# EAGLE design ARE_adaptadora_STM32_64pin (EAGLE 6.5.0)
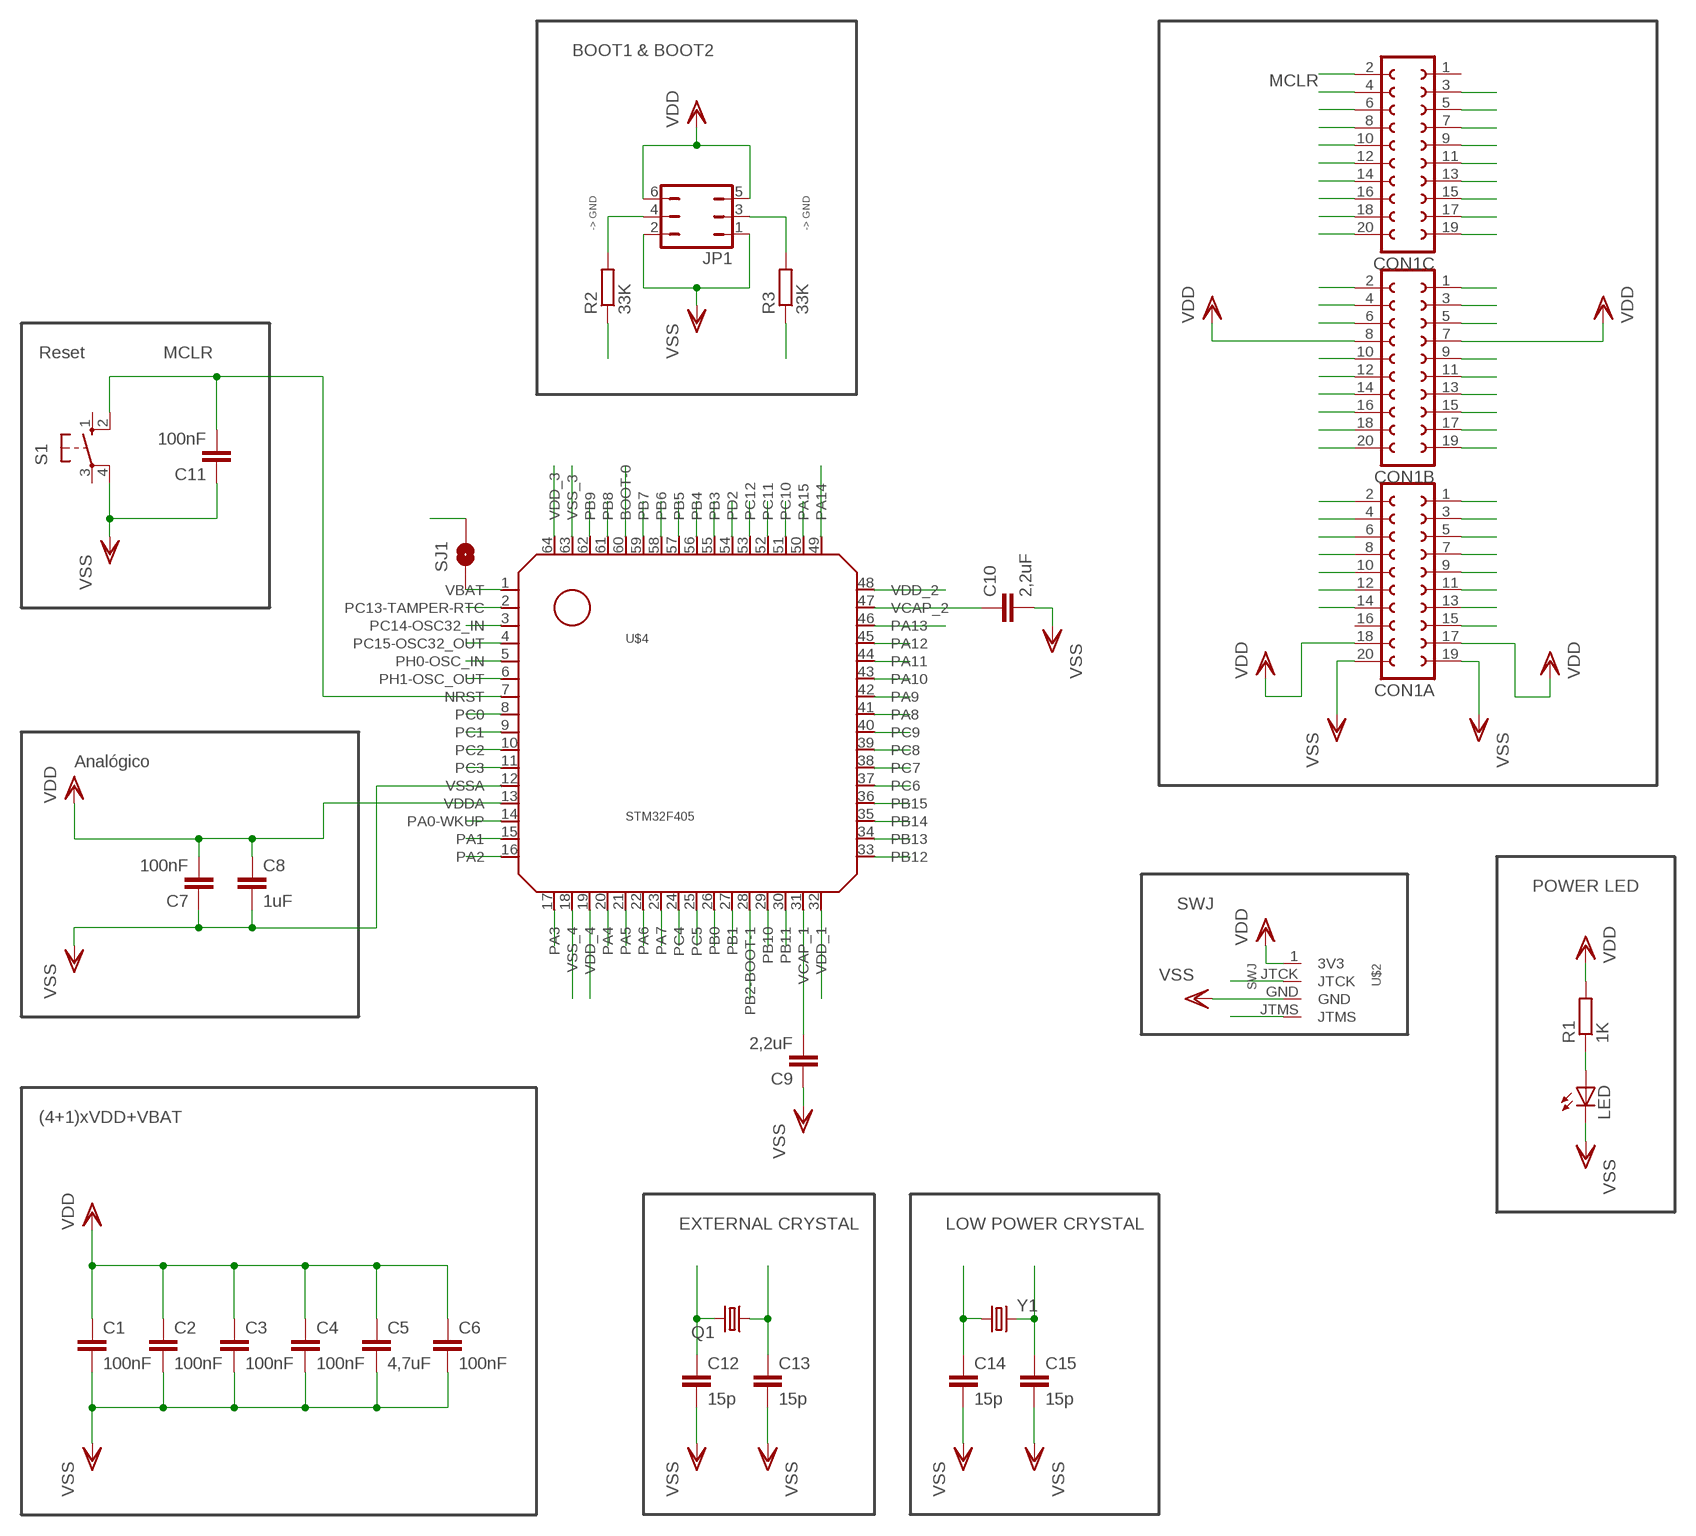
[diagram p0: schematic, sheet 1]

## Parts
C1  100nF  C-EUC0805K  [C0805K]
C2  100nF  C-EUC0805K  [C0805K]
C3  100nF  C-EUC0805K  [C0805K]
C4  100nF  C-EUC0805K  [C0805K]
C5  4,7uF  C-EUC0805K  [C0805K]
C6  100nF  C-EUC0805K  [C0805K]
C7  100nF  C-EUC0805K  [C0805K]
C8  1uF  C-EUC0805K  [C0805K]
C9  2,2uF  C-EUC0805K  [C0805K]
C10  2,2uF  C-EUC0805K  [C0805K]
C11  100nF  C-EUC0805K  [C0805K]
C12  15p  C-EUC0805  [C0805]
C13  15p  C-EUC0805  [C0805]
C14  15p  C-EUC0805  [C0805]
C15  15p  C-EUC0805  [C0805]
CON1A  FE10-2W  [FE10-2W]
CON1B  FE10-2W  [FE10-2W]
CON1C  FE10-2W  [FE10-2W]
JP1  JP3Q  [JP3Q]
LED  LEDCHIPLED_0805  [CHIPLED_0805]
Q1  CRYSTALHC18U-V  [HC18U-V]
R1  1K  R-EU_R0805  [R0805]
R2  33K  R-EU_R0805  [R0805]
R3  33K  R-EU_R0805  [R0805]
S1  10-XX  [B3F-10XX]
SJ1  SOLDERJUMPERNO  [SJ_2S-NO]
U$2  SWJ  [SWJ]
U$4  STM32F405  [LQFP64]
Y1  CRYSTAL32-SMD  [CRYSTAL-32KHZ-SMD]

## Nets
BOOT0: R2.1 U$4.60(BOOT-0)
BOOT1: CON1B.3 R3.1 U$4.28(PB2-BOOT-1)
JTCK: CON1A.3 U$2.JTCK U$4.49(PA14)
JTMS: CON1A.2 U$2.JTMS U$4.46(PA13)
MCLR: C11.2 CON1C.2 S1.2(S1) U$4.7(NRST)
N$22: C10.1 U$4.47(VCAP_2)
N$23: C9.2 U$4.31(VCAP_1)
N$24: CON1C.4 U$4.2(PC13-TAMPER-RTC)
N$25: LED.A R1.1
N$33: CON1C.7 U$4.8(PC0)
N$34: CON1C.10 U$4.9(PC1)
N$35: CON1C.9 U$4.10(PC2)
N$36: CON1C.12 U$4.11(PC3)
N$37: CON1C.11 U$4.14(PA0-WKUP)
N$38: CON1C.14 U$4.15(PA1)
N$39: CON1C.13 U$4.16(PA2)
N$40: CON1C.16 U$4.17(PA3)
N$41: CON1C.15 U$4.20(PA4)
N$42: CON1C.18 U$4.21(PA5)
N$43: CON1C.17 U$4.22(PA6)
N$44: CON1C.20 U$4.23(PA7)
N$45: CON1C.19 U$4.24(PC4)
N$46: CON1B.2 U$4.25(PC5)
N$47: CON1B.1 U$4.26(PB0)
N$48: CON1B.4 U$4.27(PB1)
N$49: CON1B.6 U$4.29(PB10)
N$50: CON1B.5 U$4.30(PB11)
N$51: CON1B.9 U$4.33(PB12)
N$52: CON1B.10 U$4.34(PB13)
N$53: CON1B.11 U$4.35(PB14)
N$54: CON1B.12 U$4.36(PB15)
N$55: CON1B.13 U$4.37(PC6)
N$56: CON1B.14 U$4.38(PC7)
N$57: CON1B.15 U$4.39(PC8)
N$58: CON1B.16 U$4.40(PC9)
N$59: CON1B.17 U$4.41(PA8)
N$60: CON1B.18 U$4.42(PA9)
N$61: CON1B.19 U$4.43(PA10)
N$62: CON1B.20 U$4.44(PA11)
N$63: CON1A.1 U$4.45(PA12)
N$64: CON1A.4 U$4.50(PA15)
N$65: CON1A.5 U$4.51(PC10)
N$66: CON1A.6 U$4.52(PC11)
N$67: CON1A.7 U$4.53(PC12)
N$68: CON1A.8 U$4.54(PD2)
N$69: CON1A.9 U$4.55(PB3)
N$70: CON1A.10 U$4.56(PB4)
N$72: CON1A.11 U$4.57(PB5)
N$73: CON1A.12 U$4.58(PB6)
N$74: CON1A.13 U$4.59(PB7)
N$75: CON1A.14 U$4.61(PB8)
N$76: CON1A.15 U$4.62(PB9)
N$77: JP1.4 R2.2
N$78: JP1.3 R3.2
P12OSC0: C13.1 CON1C.5 Q1.1 U$4.5(PH0-OSC_IN)
P12OSC1: C12.1 CON1C.8 Q1.2 U$4.6(PH1-OSC_OUT)
P12OSC320: C14.1 CON1C.3 U$4.3(PC14-OSC32_IN) Y1.X1
P12OSC321: C15.1 CON1C.6 U$4.4(PC15-OSC32_OUT) Y1.X2
VBAT: SJ1.1 U$4.1(VBAT)
VDD: C1.1 C2.1 C3.1 C4.1 C5.1 C6.1 C7.2 C8.1 CON1A.17 CON1A.18 CON1B.7 CON1B.8 JP1.5 JP1.6 R1.2 SJ1.2 U$2.1(3V3) U$4.13(VDDA) U$4.19(VDD_4) U$4.32(VDD_1) U$4.48(VDD_2) U$4.64(VDD_3)
VSS: C1.2 C2.2 C3.2 C4.2 C5.2 C6.2 C7.1 C8.2 C9.1 C10.2 C11.1 C12.2 C13.2 C14.2 C15.2 CON1A.19 CON1A.20 JP1.1 JP1.2 LED.C S1.4(P1) U$2.GND U$4.12(VSSA) U$4.18(VSS_4) U$4.63(VSS_3)
Unconnected: CON1A.16 CON1C.1 S1.1(S) S1.3(P)

## Notes on the sheet
- BOOT1 & BOOT2
- -> GND | -> GND
- Reset
- Analógico
- POWER LED
- SWJ
- (4+1)xVDD+VBAT
- EXTERNAL CRYSTAL | LOW POWER CRYSTAL

## Library data of the parts
C1-C15 = rcl:C-EU: CAPACITOR, European symbol
CON1A CON1B CON1C = con-lsta:FE10-2W: FEMALE HEADER; OC_FARNELL: unknown; OC_NEWARK: unknown
JP1 = jumper:JP3Q: JUMPER
LED = led:LED: LED OSRAM: - CHIPLED LG R971, LG N971, LY N971, LG Q971, LY Q971, LO R971, LY R971 LH N974, LH R974 LS Q976, LO Q976, LY Q976 LO Q996 - Hyper CHIPLED LW Q18S LB Q993, LB Q99A, LB R99A - SideLED LS A670, LO A670, LY A670, LG A670, LP A670 LB A673, LV A673, LT A673, LW A673 LH A674 LY A675 LS A676, LA A676, LO A676, LY A676, LW A676 LS A679, LY A679, LG A679 - Hyper Micro SIDELED® LS Y876, LA Y876, LO Y876, LY Y876 LT Y87S - SmartLED LW L88C, LW L88S LB L89C, LB L89S, LG L890 LS L89K, LO L89K, LY L89K LS L896, LA L896, LO L896, LY L896 - TOPLED LS T670, LO T670, LY T670, LG T670, LP T670 LSG T670, LSP T670, LSY T670, LOP T670, LYG T670 LG T671, LOG T671, LSG T671 LB T673, LV T673, LT T673, LW T673 LH T674 LS T676, LA T676, LO T676, LY T676, LB T676, LH T676, LSB T676, LW T676 LB T67C, LV T67C, LT T67C, LS T67K, LO T67K, LY T67K, LW E67C LS E67B, LA E67B, LO E67B, LY E67B, LB E67C, LV E67C, LT E67C LW T67C LS T679, LY T679, LG T679 LS T770, LO T770, LY T770, LG T770, LP T770 LB T773, LV T773, LT T773, LW T773 LH T774 LS E675, LA E675, LY E675, LS T675 LS T776, LA T776, LO T776, LY T776, LB T776 LHGB T686 LT T68C, LB T68C - Hyper Mini TOPLED® LB M676 - Mini TOPLED Santana® LG M470 LS M47K, LO M47K, LY M47K Source: http://www.osram.convergy.de LUXEON: - LUMILED® LXK2-PW12-R00, LXK2-PW12-S00, LXK2-PW14-U00, LXK2-PW14-V00 LXK2-PM12-R00, LXK2-PM12-S00, LXK2-PM14-U00 LXK2-PE12-Q00, LXK2-PE12-R00, LXK2-PE12-S00, LXK2-PE14-T00, LXK2-PE14-U00 LXK2-PB12-K00, LXK2-PB12-L00, LXK2-PB12-M00, LXK2-PB14-N00, LXK2-PB14-P00, LXK2-PB14-Q00 LXK2-PR12-L00, LXK2-PR12-M00, LXK2-PR14-Q00, LXK2-PR14-R00 LXK2-PD12-Q00, LXK2-PD12-R00, LXK2-PD12-S00 LXK2-PH12-R00, LXK2-PH12-S00 LXK2-PL12-P00, LXK2-PL12-Q00, LXK2-PL12-R00 Source: www.luxeon.com KINGBRIGHT: KA-3528ASYC Source: www.kingbright.com
Q1 = crystal:CRYSTAL: CRYSTAL; OC_FARNELL: unknown; OC_NEWARK: unknown
R1-R3 = rcl:R-EU_: RESISTOR, European symbol
S1 = switch-omron:10-XX: OMRON SWITCH; MPN: B3F-1000; OC_FARNELL: 176432; OC_NEWARK: 36M3542
SJ1 = SparkFun-Passives:SOLDERJUMPER: Solder Jumper Standard SMD solder jumper. Used to automate production. Two varients : Normally Open and Normally Closed are the same, but have different paste layers. NC will have a large amount of paste and should jumper during reflow.
U$2 = Propio:SWJ
U$4 = Propio:STM32F405
Y1 = SparkFun-FreqCtrl:CRYSTAL: Various standard crystals. Proven footprints. Spark Fun Electronics SKU : COM-00534

## Board
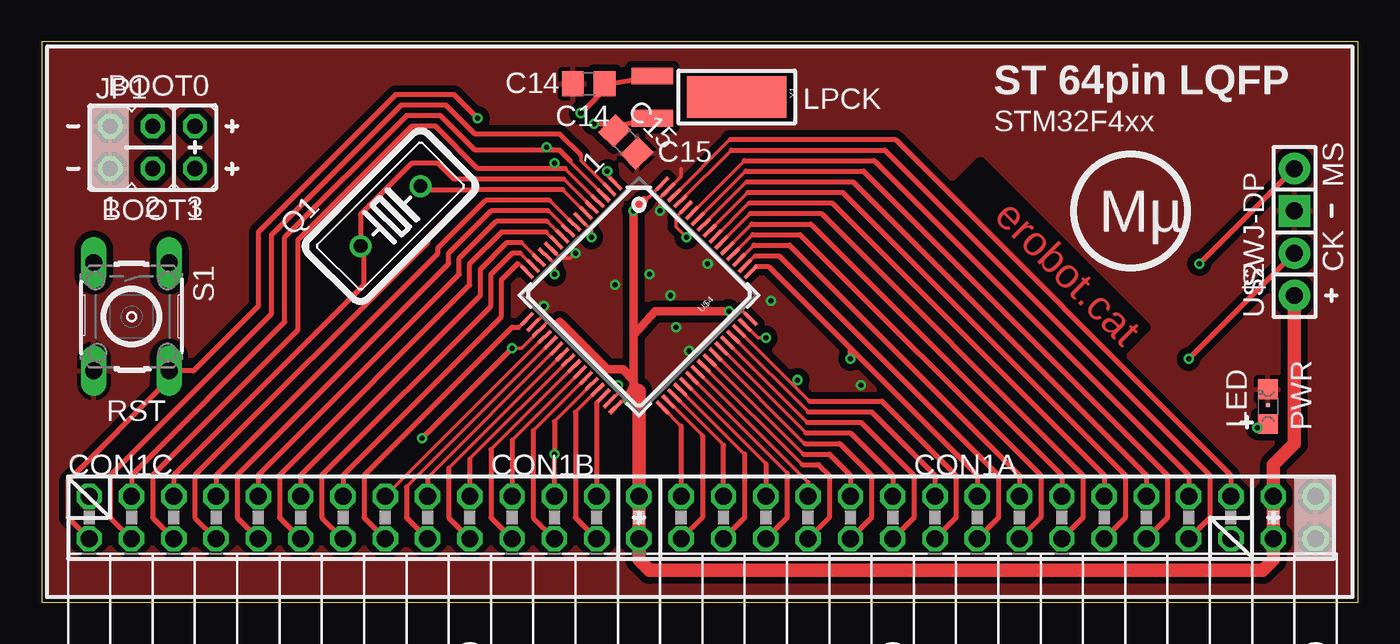
[diagram p1: board, top side]
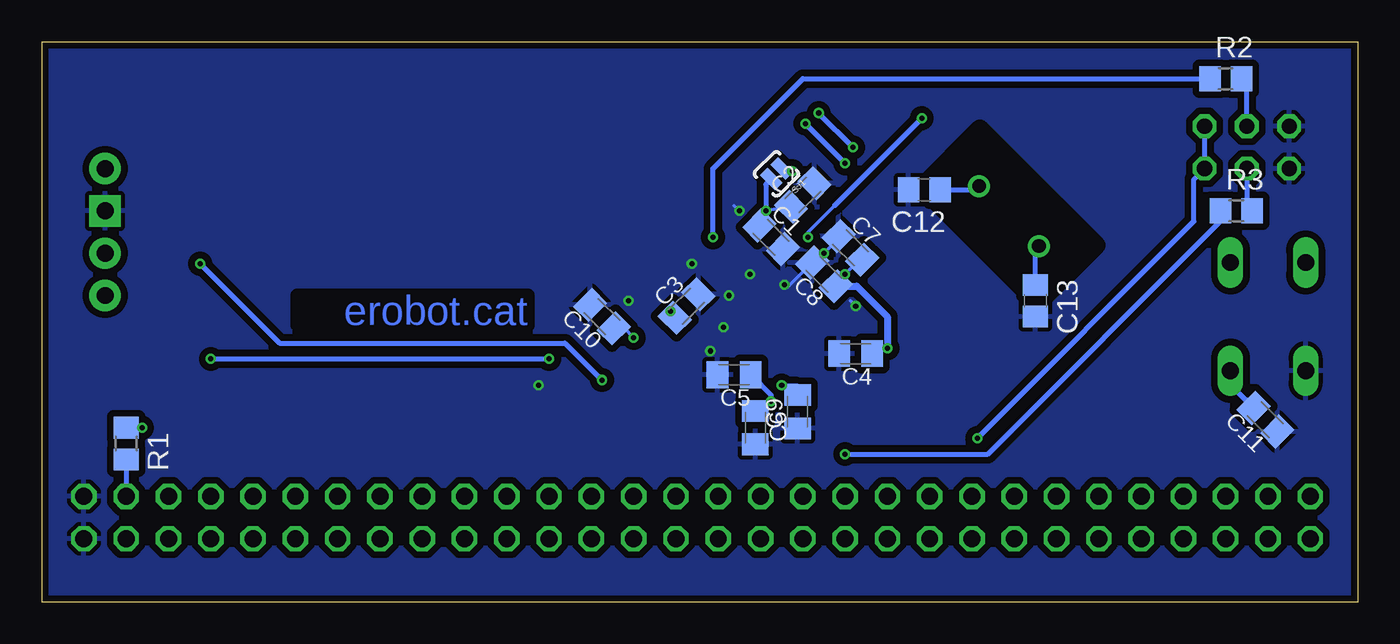
[diagram p2: board, bottom side, seen from below]

Size 79.06 x 33.66 mm. Coordinates in mm from the lower left corner, seen from the top.
Outline: 0,0 79.06,0 79.06,33.65 0,33.65 0,0
Copper layers (1*16): Top 0.035mm / dielectric 1.5mm / Bottom 0.035mm
Design rules "ITEADstudio_DRC": minimum track width 6mil, minimum drill 12mil, track to track 6mil, track to pad 6mil, pad to pad 6mil, via to via 6mil, smd to smd 0mil, copper to edge 10mil, drill to drill 10mil, minimum pad ring 10mil, minimum via ring 6mil, stop-mask expansion 2mil, vias tented up to drill 100mil, thermal gap 10mil
bRestrict: area 15.7,17.9 to 26.2,28.4

### Footprints (pad centres in the part's own frame; a part is rotated, then mirrored left to right if it is on the bottom)
C0805K = smd 1.3 x 1.6: 1 -1,0; 2 1,0
C0805 = smd 1.3 x 1.5: 1 -0.95,0; 2 0.95,0
FE10-2W = drill 1.016 octagon: 1 -11.43,1.27; 2 -11.43,-1.27; 3 -8.89,1.27; 4 -8.89,-1.27; 5 -6.35,1.27; 6 -6.35,-1.27; 7 -3.81,1.27; 8 -3.81,-1.27; 9 -1.27,1.27; 10 -1.27,-1.27; 11 1.27,1.27; 12 1.27,-1.27; 13 3.81,1.27; 14 3.81,-1.27; 15 6.35,1.27; 16 6.35,-1.27; 17 8.89,1.27; 18 8.89,-1.27; 19 11.43,1.27; 20 11.43,-1.27
JP3Q = drill 0.914 octagon: 1 -2.54,-1.27; 2 -2.54,1.27; 3 0,-1.27; 4 0,1.27; 5 2.54,-1.27; 6 2.54,1.27
CHIPLED_0805 = smd 1.2 x 1.2: A 0,-1.05; C 0,1.05
HC18U-V = drill 0.813: 1 -2.54,0; 2 2.54,0
R0805 = smd 1.3 x 1.5: 1 -0.95,0; 2 0.95,0
B3F-10XX = drill 1.016 long: 1 -3.251,2.261; 2 3.251,2.261; 3 -3.251,-2.261; 4 3.251,-2.261
SJ_2S-NO = smd 0.635 x 1.27: 1 -0.45,0; 2 0.45,0
SWJ = drill 1.016 pad 1.88: 1 -5.08,0; JTCK -2.54,0; JTMS 2.54,0 | drill 1.016 pad 1.88 square: GND 0,0
LQFP64 = smd 0.22 x 1: 1 -3.75,-5.75; 2 -3.25,-5.75; 3 -2.75,-5.75; 4 -2.25,-5.75; 5 -1.75,-5.75; 6 -1.25,-5.75; 7 -0.75,-5.75; 8 -0.25,-5.75; 9 0.25,-5.75; 10 0.75,-5.75; 11 1.25,-5.75; 12 1.75,-5.75; 13 2.25,-5.75; 14 2.75,-5.75; 15 3.25,-5.75; 16 3.75,-5.75; 33 3.75,5.75; 34 3.25,5.75; 35 2.75,5.75; 36 2.25,5.75; 37 1.75,5.75; 38 1.25,5.75; 39 0.75,5.75; 40 0.25,5.75; 41 -0.25,5.75; 42 -0.75,5.75; 43 -1.25,5.75; 44 -1.75,5.75; 45 -2.25,5.75; 46 -2.75,5.75; 47 -3.25,5.75; 48 -3.75,5.75 | smd 1 x 0.22: 17 5.75,-3.75; 18 5.75,-3.25; 19 5.75,-2.75; 20 5.75,-2.25; 21 5.75,-1.75; 22 5.75,-1.25; 23 5.75,-0.75; 24 5.75,-0.25; 25 5.75,0.25; 26 5.75,0.75; 27 5.75,1.25; 28 5.75,1.75; 29 5.75,2.25; 30 5.75,2.75; 31 5.75,3.25; 32 5.75,3.75; 49 -5.75,3.75; 50 -5.75,3.25; 51 -5.75,2.75; 52 -5.75,2.25; 53 -5.75,1.75; 54 -5.75,1.25; 55 -5.75,0.75; 56 -5.75,0.25; 57 -5.75,-0.25; 58 -5.75,-0.75; 59 -5.75,-1.25; 60 -5.75,-1.75; 61 -5.75,-2.25; 62 -5.75,-2.75; 63 -5.75,-3.25; 64 -5.75,-3.75
CRYSTAL-32KHZ-SMD = smd 2.5 x 6: SHEILD 0,5.08 | smd 1 x 2.5: X1 -1.27,0; X2 1.27,0

### Placement (x,y rotation side)
C1  35.24,21.91 315 bottom
C2  33.34,24.45 45 bottom
C3  40.32,17.78 45 bottom
C4  30.16,14.92 180 bottom
C5  37.47,13.65 180 bottom
C6  36.2,10.48 270 bottom
C7  30.48,21.27 315 bottom
C8  32.07,19.68 135 bottom
C9  33.66,11.43 90 bottom
C10  45.4,17.14 135 bottom
C11  5.56,10.95 135 bottom
C12  26.04,24.77 180 bottom
C13  19.37,18.1 270 bottom
C14  32.86,31.12 180 top
C15  35.08,27.62 315 top
CON1A  65.09,5.08 0 top
CON1B  39.69,5.08 0 top
CON1C  14.29,5.08 0 top
JP1  6.67,27.3 0 top
LED  73.66,11.75 0 top
Q1  20.96,23.18 45 top
R1  73.98,9.52 270 bottom
R2  7.94,31.43 0 bottom
R3  7.3,23.49 0 bottom
S1  5.4,17.14 270 top
SJ1  34.92,25.72 225 bottom
U$2  75.25,23.49 90 top
U$4  35.88,18.41 225 top
Y1  36.67,30.32 270 top

### Tracks (layer width: path | path; a pad name or v marks a point on that pad's centre or on a via)
BOOT0  (via drill 0.3 pad 0.61)
  Top 0.203: U$4.60 38.1,23.11 38.1,22.54 v38.73,21.91
  Bottom 0.305: 9.21,31.43 8.89,31.12 R2.1 33.34,31.43 38.73,26.04 v38.73,21.91
BOOT1  (via drill 0.3 pad 0.61)
  Top 0.203: U$4.28 30.8,10.86
  Top 0.305: 30.8,10.86 v30.8,8.89 CON1B.3
  Bottom 0.305: v30.8,8.89 22.23,8.89 8.25,22.86 R3.1 8.25,23.17
JTCK  (via drill 0.3 pad 0.61)
  Top 0.203: U$4.49 42.93,20.16
  Top 0.305: 42.93,20.16 43.66,20.16 48.58,15.24 | 48.58,15.24 56.2,7.62 CON1A.3 | v48.58,14.61 48.58,15.24 | U$2.JTCK v68.9,14.61
  Bottom 0.305: v68.9,14.61 v48.58,14.61
JTMS  (via drill 0.3 pad 0.61)
  Top 0.203: U$4.46 45.12,13.06 | 45.12,13.06 46.12,12.06 | v45.4,13.33 45.12,13.06
  Top 0.305: 46.12,12.06 50.48,12.06 54.93,7.62 54.93,5.08 CON1A.2 | v69.53,20.32 U$2.JTMS
  Bottom 0.305: v45.4,13.33 47.62,15.56 64.77,15.56 v69.53,20.32
MCLR  (via drill 0.3, 0.3 pad 0.61)
  Top 0.203: U$4.7 33.02,22.33 v33.02,21.91
  Top 0.305: v26.19,29.05 24.77,30.48 21.27,30.48 13.02,22.23 13.02,17.78 9.13,13.89 S1.2 | CON1C.2 1.59,5.08 1.59,7.3 7.66,13.37 S1.2 | 7.66,13.85 S1.2 | 7.66,13.97 S1.2
  Bottom 0.203: v33.02,21.91 33.02,22.23 31.43,23.81
  Bottom 0.305: 31.43,23.81 v26.19,29.05 | 6.67,12.06 7.66,13.06 S1.2
  Bottom 0.406: C11.2 6.67,12.06
N$22  (via drill 0.3 pad 0.61)
  Top 0.203: U$4.47 43.01,15.87 v43.5,15.87
  Bottom 0.203: v43.5,15.87 44.06,16.44 C10.1
N$23  (via drill 0.3 pad 0.61)
  Top 0.203: U$4.31 34.61,12.55 v34.61,13.02
  Bottom 0.203: C9.2 33.66,13.02 v34.61,13.02
N$24
  Top 0.203: U$4.2 32.38,26.5 32.38,26.83
  Top 0.305: CON1C.4 4.13,5.08 4.13,7.62 13.81,17.3 13.81,22.07 21.59,29.84 24.29,29.84 26.04,28.1 31.12,28.1 32.38,26.83
N$25  (via drill 0.3 pad 0.61)
  Top 0.305: v73.03,10.48 73.76,10.48 LED.A
  Bottom 0.305: R1.1 v73.03,10.48
N$33
  Top 0.203: U$4.8 30.52,24.13
  Top 0.305: 30.52,24.13 26.67,24.13 23.81,21.27 23.81,20.96 10.48,7.62 CON1C.7
N$34
  Top 0.203: U$4.9 30.44,23.49
  Top 0.305: 30.44,23.49 26.99,23.49 24.45,20.96 24.45,20.32 11.75,7.62 11.75,5.08 CON1C.10
N$35
  Top 0.203: U$4.10 30.37,22.86
  Top 0.305: 30.37,22.86 27.3,22.86 25.08,20.64 25.08,19.68 13.02,7.62 CON1C.9
N$36
  Top 0.203: U$4.11 30.3,22.23
  Top 0.305: 30.3,22.23 27.62,22.23 25.72,20.32 25.72,19.05 14.29,7.62 14.29,5.08 CON1C.12
N$37
  Top 0.203: U$4.14 28.81,21.59
  Top 0.305: 28.81,21.59 27.94,21.59 26.35,20 26.35,18.42 15.56,7.62 CON1C.11
N$38
  Top 0.203: U$4.15 28.74,20.96
  Top 0.305: 28.74,20.96 28.26,20.96 26.99,19.68 26.99,17.78 16.83,7.62 16.83,5.08 CON1C.14
N$39
  Top 0.203: U$4.16 28.67,20.32 28.58,20.32
  Top 0.305: CON1C.13 18.1,7.62 27.62,17.14 27.62,19.37 28.58,20.32
N$40
  Top 0.203: U$4.17 28.67,16.51
  Top 0.305: CON1C.16 19.37,5.08 19.37,7.62 28.26,16.51 28.67,16.51
N$41
  Top 0.203: U$4.20 CON1C.15
N$42
  Top 0.203: U$4.21 21.91,6.92
  Top 0.305: 21.91,6.92 21.91,5.08 CON1C.18
N$43
  Top 0.203: U$4.22 23.18,7.48
  Top 0.305: 23.18,7.48 CON1C.17
N$44
  Top 0.203: U$4.23 24.45,8.05
  Top 0.305: 24.45,8.05 24.45,5.08 CON1C.20
N$45
  Top 0.203: U$4.24 25.72,8.61
  Top 0.305: 25.72,8.61 CON1C.19
N$46
  Top 0.203: U$4.25 26.99,9.17
  Top 0.305: 26.99,9.17 26.99,5.08 CON1B.2
N$47
  Top 0.203: U$4.26 28.26,9.73
  Top 0.305: 28.26,9.73 CON1B.1
N$48
  Top 0.203: U$4.27 29.53,10.3
  Top 0.305: 29.53,10.3 29.53,5.08 CON1B.4
N$49
  Top 0.203: U$4.29 32.7,12.06 32.07,11.43
  Top 0.305: 32.07,11.43 32.07,5.08 CON1B.6
N$50
  Top 0.203: U$4.30 33.34,11.99
  Top 0.305: 33.34,11.99 CON1B.5
N$51
  Top 0.203: U$4.33 38.42,10.57
  Top 0.305: 38.42,10.57 CON1B.9
N$52
  Top 0.203: U$4.34 39.69,10.01
  Top 0.305: 39.69,10.01 39.69,5.08 CON1B.10
N$53
  Top 0.203: U$4.35 40.96,9.45
  Top 0.305: CON1B.11 40.96,9.45
N$54
  Top 0.203: U$4.36 42.23,8.88
  Top 0.305: 42.23,8.88 42.23,5.08 CON1B.12
N$55
  Top 0.203: U$4.37 43.5,8.32
  Top 0.305: 43.5,8.32 CON1B.13
N$56
  Top 0.203: U$4.38 44.77,7.76
  Top 0.305: 44.77,7.76 44.77,5.08 CON1B.14
N$57
  Top 0.203: U$4.39 46.04,7.19
  Top 0.305: 46.04,7.19 CON1B.15
N$58
  Top 0.203: U$4.40 45.68,8.26
  Top 0.305: 45.68,8.26 46.67,8.26 47.31,7.62 47.31,5.08 CON1B.16
N$59
  Top 0.203: U$4.41 45.76,8.89
  Top 0.305: 45.76,8.89 47.31,8.89 48.58,7.62 CON1B.17
N$60
  Top 0.203: U$4.42 45.83,9.52
  Top 0.305: 45.83,9.52 47.94,9.52 49.85,7.62 49.85,5.08 CON1B.18
N$61
  Top 0.203: U$4.43 45.9,10.16
  Top 0.305: 45.9,10.16 48.58,10.16 51.12,7.62 CON1B.19
N$62
  Top 0.203: U$4.44 45.97,10.79
  Top 0.305: 45.97,10.79 49.21,10.79 52.39,7.62 52.39,5.08 CON1B.20
N$63
  Top 0.203: U$4.45 46.04,11.43
  Top 0.305: 46.04,11.43 49.85,11.43 53.66,7.62 CON1A.1
N$64
  Top 0.203: U$4.50 42.86,20.8
  Top 0.305: 42.86,20.8 44.29,20.8 57.47,7.62 57.47,5.08 CON1A.4
N$65
  Top 0.203: U$4.51 42.78,21.43
  Top 0.305: 42.78,21.43 44.93,21.43 58.74,7.62 CON1A.5
N$66
  Top 0.203: U$4.52 42.71,22.07
  Top 0.305: 42.71,22.07 45.56,22.07 60.01,7.62 60.01,5.08 CON1A.6
N$67
  Top 0.203: U$4.53 42.64,22.7
  Top 0.305: 42.64,22.7 46.2,22.7 61.28,7.62 CON1A.7
N$68
  Top 0.203: U$4.54 42.57,23.34
  Top 0.305: 42.57,23.34 46.83,23.34 62.55,7.62 62.55,5.08 CON1A.8
N$69
  Top 0.203: U$4.55 42.49,23.97
  Top 0.305: 42.49,23.97 47.47,23.97 63.82,7.62 CON1A.9
N$70
  Top 0.203: U$4.56 42.42,24.61
  Top 0.305: 42.42,24.61 48.1,24.61 65.09,7.62 65.09,5.08 CON1A.10
N$72
  Top 0.203: U$4.57 42.35,25.24
  Top 0.305: 42.35,25.24 48.74,25.24 66.36,7.62 CON1A.11
N$73
  Top 0.203: U$4.58 42.28,25.88
  Top 0.305: 42.28,25.88 49.37,25.88 67.63,7.62 67.63,5.08 CON1A.12
N$74
  Top 0.203: U$4.59 42.21,26.51
  Top 0.305: 42.21,26.51 50.01,26.51 68.9,7.62 CON1A.13
N$75
  Top 0.203: U$4.61 41.43,27.15
  Top 0.305: 41.43,27.15 50.64,27.15 70.17,7.62 70.17,5.08 CON1A.14
N$76
  Top 0.203: U$4.62 41.36,27.78
  Top 0.305: 41.36,27.78 51.28,27.78 71.44,7.62 CON1A.15
N$77
  Bottom 0.305: JP1.4 6.67,30.8 R2.2
N$78
  Bottom 0.305: JP1.3 6.67,23.81 R3.2
P12OSC0
  Top 0.203: U$4.5 31.37,25.4
  Top 0.305: 31.37,25.4 24.77,25.4 23.81,26.35 22.23,26.35 19.16,23.29 Q1.1 19.37,21.17 C13.1 7.94,7.62 CON1C.5
  Bottom 0.305: C13.1 19.37,21.17 Q1.1
P12OSC1
  Top 0.203: U$4.6 31.3,24.76
  Top 0.305: 31.3,24.76 26.04,24.76 | CON1C.8 9.21,5.08 9.21,7.62 23.18,21.59 23.18,21.91 26.04,24.76 | Q1.2 23.02,24.76 26.04,24.76
  Bottom 0.305: C12.1 23.02,24.76 Q1.2
P12OSC320  (via drill 0.3, 0.3 pad 0.61)
  Top 0.203: U$4.3 31.75,26.43 31.75,26.51
  Top 0.305: CON1C.3 5.4,7.62 14.61,16.83 14.61,21.91 21.91,29.21 23.97,29.21 26.04,27.15 30.8,27.15 | 31.75,26.51 31.12,27.15 30.8,27.15 | v32.38,29.37 34.13,31.12 | 34.13,31.12 Y1.X1 | C14.1 34.13,31.12 | v30.32,27.31 30.8,27.15
  Bottom 0.305: v32.38,29.37 v30.32,27.31
P12OSC321  (via drill 0.3 pad 0.61)
  Top 0.203: U$4.4 31.44,26.04
  Top 0.305: 31.44,26.04 30.8,26.04 | 30.8,26.04 26.19,26.04 23.65,28.57 22.23,28.57 15.4,21.75 15.4,16.35 6.67,7.62 6.67,5.08 CON1C.6 | Y1.X2 34.61,28.57 | 34.61,28.57 v33.18,28.73 | C15.1 34.61,28.01 34.61,28.57 | v30.8,26.35 30.8,26.04
  Bottom 0.305: v33.18,28.73 v30.8,26.35
VBAT  (via drill 0.3 pad 0.61)
  Top 0.203: U$4.1 33.97,25.62 v33.97,25.88
  Bottom 0.203: v33.97,25.88 33.97,26.04 SJ1.1
VDD  (via drill 0.3 pad 0.61)
  Top 0.203: U$4.48 42.13,17.46 v41.27,17.46 | U$4.64 36.51,24.35 36.2,24.13 | 31.12,16.83 30.4,16.83 U$4.19 28.81,15.24 v28.26,15.24 | U$4.32 34.83,12.06 v35.24,12.06 | U$4.13 30.8,20.31 v30.8,19.68
  Top 0.305: v22.86,9.84 v28.26,15.24
  Top 0.406: 35.67,12.91 35.35,12.59 35.24,12.48 v35.24,12.06
  Top 0.508: 35.56,16.03 v35.56,23.49 36.2,24.13 | v41.27,17.46 36.83,17.46 35.56,16.03 | 35.56,16.03 35.56,13.33 | 35.56,13.33 35.56,13.02 35.35,12.59 | 31.12,16.83 33.97,13.97 34.92,13.97 35.56,13.33
  Top 0.61: 35.88,12.7 35.67,12.91
  Top 0.813: 35.88,12.7 CON1B.7 CON1B.8 35.88,2.54 36.51,1.9 73.34,1.9 73.98,2.54 CON1A.18 CON1A.17 73.98,8.26 75.25,9.52 U$2.1
  Bottom 0.203: v41.27,17.46 C3.1 | v35.24,12.06 35.8,11.5 C6.1 | C2.1 33.81,23.92 34.77,23.65 v35.56,23.49 | C4.1 v28.26,15.24 | C7.2 29.6,20.88 v30.8,19.68 30.8,19.54 C8.1
  Bottom 0.305: JP1.6 JP1.5 9.84,25.4 9.84,22.86 v22.86,9.84 | R1.2 CON1A.17 | 29.45,20.57 C7.2 | C5.1 35.24,12.43 v35.24,12.06 | SJ1.2 35.56,25.08 v35.56,23.49 35.56,23 C1.1
  Bottom 0.406: C8.1 30.09,18.98 28.26,17.14 v28.26,15.24
VSS  (via drill 0.3 pad 0.61)
  Top 0.203: v37.15,23.49 37.15,24.28 U$4.63 38.42,25.55 38.42,26.04 | U$4.18 30.16,17.3 v30.16,17.78 | U$4.12 31.18,20.64 31.75,20.64 v32.07,20.96
  Bottom 0.203: v30.16,17.78 30.48,18.1 | 37.47,23.81 v37.15,23.49 | C7.1 30.87,22.15 v32.07,20.96 32.21,20.96 C8.2 34.25,18.91
  other vias: 43.81,18.1 36.51,19.68 40.01,20.32 38.89,15.08 49.21,13.02 37.78,18.41 38.1,16.51 34.45,19.05
  pour Bottom (isolate 0.406): 0,0 79.06,0 79.06,33.66 0,33.66
  pour Top (isolate 0.406): 0,0 79.06,0 79.06,33.66 0,33.66

### Text on the board
Top: erobot.cat
Bottom: erobot.cat
_tsilk: C14 | BOOT0 | ST 64pin LQFP | LPCK | STM32F4xx | C15 | 1 | MS | BOOT1 | Mµ | CK | SWJ-DP | RST | PWR
_bsilk: R2 | SJ1: / VBAT=VCC | C12 | C2 | SJ1 | R3 | C7 | C1 | C10 | C8 | C3 | C13 | C5 | C4 | C9 | CC by nc sa | C11 | C6 | dragonet80 - 2014 | R1